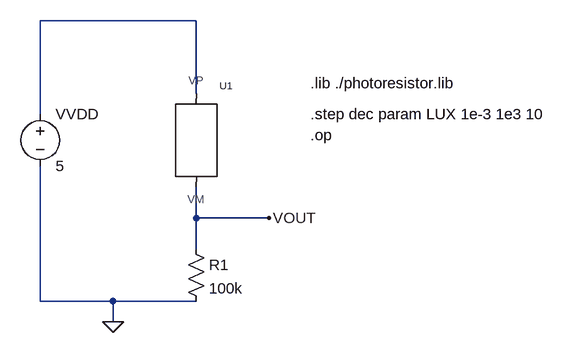
[diagram p0: schematic Shematic1.asc]
Shematic1.asc, the LTspice schematic file:
Version 4
SHEET 1 880 680
WIRE 176 -16 -64 -16
WIRE 176 96 176 -16
WIRE -64 128 -64 -16
WIRE 176 288 176 240
WIRE 288 288 176 288
WIRE 176 336 176 288
WIRE -64 416 -64 208
WIRE 48 416 -64 416
WIRE 176 416 48 416
WIRE 48 448 48 416
FLAG 48 448 0
FLAG 288 288 VOUT
SYMBOL photoresistor 176 160 R0
SYMATTR InstName U1
SYMBOL voltage -64 112 R0
WINDOW 123 0 0 Left 0
WINDOW 39 0 0 Left 0
SYMATTR InstName VVDD
SYMATTR Value 5
SYMBOL res 160 320 R0
SYMATTR InstName R1
SYMATTR Value 100k
TEXT 352 80 Left 2 !.lib ./photoresistor.lib
TEXT 352 160 Left 2 !.op
TEXT 352 128 Left 2 !.step dec param LUX 1e-3 1e3 10

The netlist it stands for:
* Shematic1.asc
XU1 N001 VOUT photoresistor  ; pins VP VM
VVDD N001 0 5
R1 VOUT 0 100k
.lib ./photoresistor.lib
.op
.step dec param LUX 1e-3 1e3 10
.backanno
.end

* Results of the author's LTspice run, read from the files saved beside the schematic
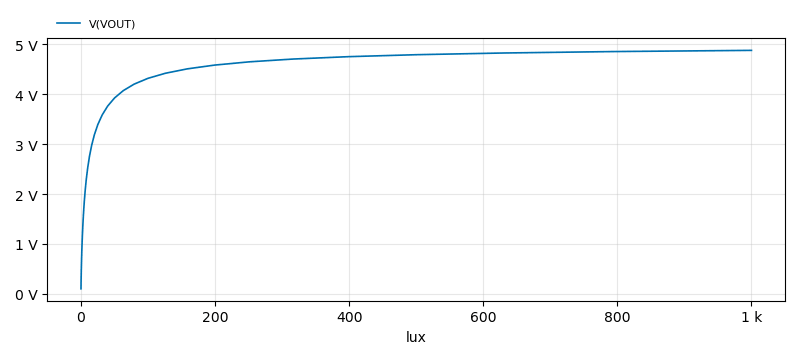
[diagram p1: Operating Point of Shematic1.asc, plotted from the saved traces]
* Operating Point, 1 run:
*   V(VOUT): 101.1 mV at lux=1 m, 4.878 V at lux=1 k, min 101.1 mV, max 4.878 V